# Altium schematic sheet Sheet2.SchDoc
size A4; DocumentNumber: 1; SheetNumber: 2; SheetTotal: 2
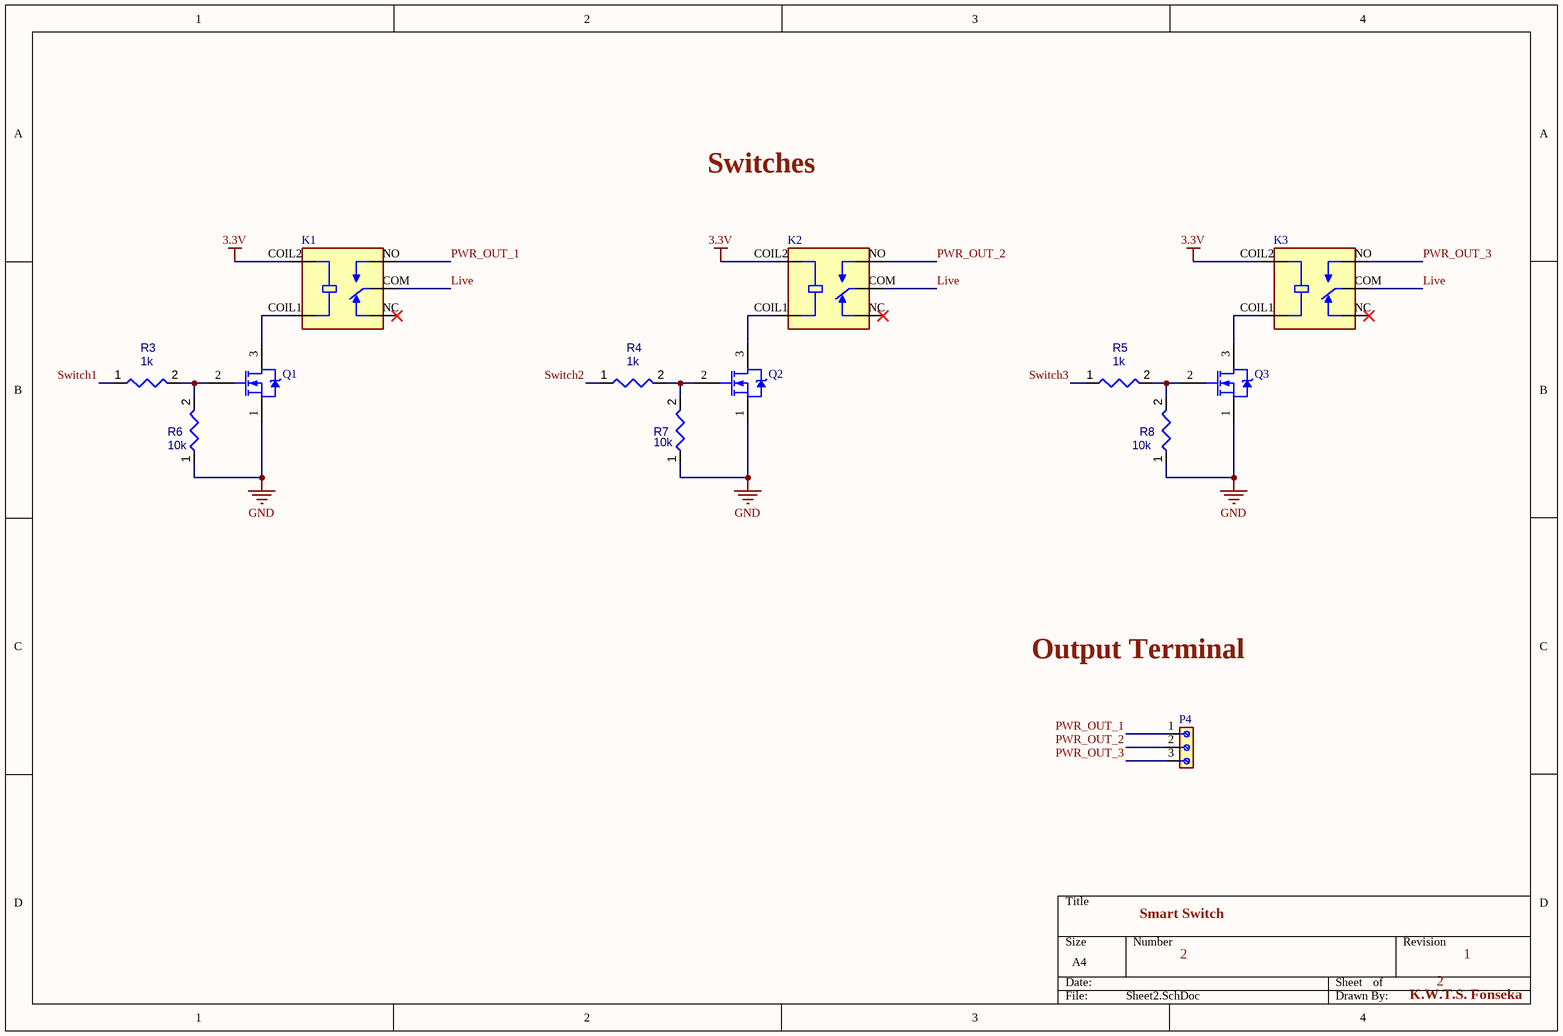
[diagram p0: Sheet2.SchDoc]

## Parts
K1  SRD-03VDC-SL-C  [RELAY_SRD-03VDC-SL-C]  (value not drawn)
K2  SRD-03VDC-SL-C  [RELAY_SRD-03VDC-SL-C]  (value not drawn)
K3  SRD-03VDC-SL-C  [RELAY_SRD-03VDC-SL-C]  (value not drawn)
P4  (no value)  [691502710003]
Q1  2N7000  [ONSC-TO-92-3-29-11]  (value not drawn)
Q2  2N7000  [ONSC-TO-92-3-29-11]  (value not drawn)
Q3  2N7000  [ONSC-TO-92-3-29-11]  (value not drawn)
R3  1k  [RESC2013X50X35ML15T15]
R4  1k  [RESC2013X50X35ML15T15]
R5  1k  [RESC2013X50X35ML15T15]
R6  10k  [RESC2013X70X40ML20T20]
R7  10k  [RESC2013X70X40ML20T20]
R8  10k  [RESC2013X70X40ML20T20]

## Nets
3.3V: K1.COIL2 K2.COIL2 K3.COIL2
GND: Q1.1(S) Q2.1(S) Q3.1(S) R6.1 R7.1 R8.1
Live: K1.COM K2.COM K3.COM
PWR_OUT_1: K1.NO P4.1
PWR_OUT_2: K2.NO P4.2
PWR_OUT_3: K3.NO P4.3
Switch1: R3.1
Switch2: R4.1
Switch3: R5.1
NetK1_COIL1: K1.COIL1 Q1.3(D)
NetK2_COIL1: K2.COIL1 Q2.3(D)
NetK3_COIL1: K3.COIL1 Q3.3(D)
NetQ1_2: Q1.2(G) R3.2 R6.2
NetQ2_2: Q2.2(G) R4.2 R7.2
NetQ3_2: Q3.2(G) R5.2 R8.2

Not connected (* = marked no-connect by the designer): K1 NC*; K2 NC*; K3 NC*

## Notes on the sheet
- Switches
- Output Terminal
- Smart Switch
- 1
- K.W.T.S. Fonseka

## Library data of the parts
K1-K3 = SRD-03VDC-SL-C: Relays General Purpose Non Latching 3VDC SPDT 10A (250VAC) Max 5PIN; MF: Songle Relay; Value: *; Price: None; Package: Package; Availability: Not in stock; Check_prices: https://www.snapeda.com/parts/SRD-03VDC-SL-C/Songle+Relay/view-part/?ref=eda; MP: SRD-03VDC-SL-C; SnapEDA_Link: https://www.snapeda.com/parts/SRD-03VDC-SL-C/Songle+Relay/view-part/?ref=snap
P4 = CMP-003-000000-1: 5.00 MM TERMINAL BLOCK, HORIZONT; MF: WÃ¼rth Elektronik; Check_prices: https://www.snapeda.com/parts/691502710003/Wurth+Electronics+Inc./view-part/?ref=eda; Pin Count: 3; Package: None; Source: 691502710003.SchLib; Value: *; Availability: In Stock; Price: None; Design Item ID: 691502710003; SnapEDA_Link: https://www.snapeda.com/parts/691502710003/Wurth+Electronics+Inc./view-part/?ref=snap; Component Type: Standard; MP: 691502710003; Purchase-URL: https://pricing.snapeda.com/search/part/691502710003/?ref=eda
Q1-Q3 = CMP-1058-00936-1: Small Signal MOSFET, 200 mA, 60 V, N-Channel, 3-Pin TO-92, Bulk Box; Manufacturer: On Semiconductor; Ciss Typ (pF): 60; VGS(th) Max (V): 3; Crss Typ (pF): 5; Channel Polarity: N Channel; VGS Max (V): 20; Configuration: Single; PD Max (W): 0.35; Coss Typ (pF): 25; ID Max (A): 0.2; PackageVersion: Rev. AM; ComponentLink3URL: http://www.onsemi.cn/pub_link/Collateral/2N6426-D.PDF; ComponentLink2URL: http://www.onsemi.com/pub_link/Collateral/2N7000-D.PDF; DatasheetVersion: Rev. 8; Mounting Technology: Through Hole; V(BR)DSS Min (V): 60; PartNumber: 2N7000; PackageDescription: 3-Pin Transistor Outline, Body 4.825 x 3.685 mm, Pitch 1.27 mm; ComponentLink2Description: Datasheet; ComponentLink1URL: http://www.onsemi.com/; PackageReference: TO-92-3-29-11_AM_SL; Packing: Bulk Box; ComponentLink1Description: Manufacturer URL; Package Type: TO-92; ComponentLink3Description: Package Specification
R3-R5 = CMP-009-00018-5: Chip Resistor, 10 KOhm, +/- 1%, 125 mW, -55 to 155 degC, 0805 (2012 Metric); Voltage Rating: 150V; Value: 10k; Power: 125mW; Tolerance: 1%; Pins: 2; Min Operating Temperature: -55°C; Case/Package: 0805; Max Operating Temperature: 155°C; RoHS Compliant: True; Mounting Technology: SM
R6-R8 = CMP-009-00024-5: Chip Resistor, 100 KOhm, +/- 1%, 0.125 W, -55 to 155 degC, 0805 (2012 Metric); Voltage Rating: 150V; Value: 100k; Power: 125mW; Tolerance: 1%; Max Operating Temperature: 155°C; Mounting Technology: SM; RoHS Compliant: True; Case/Package: 0805; Min Operating Temperature: -55°C; Pins: 2